# Altium schematic sheet Casing.SchDoc
size A
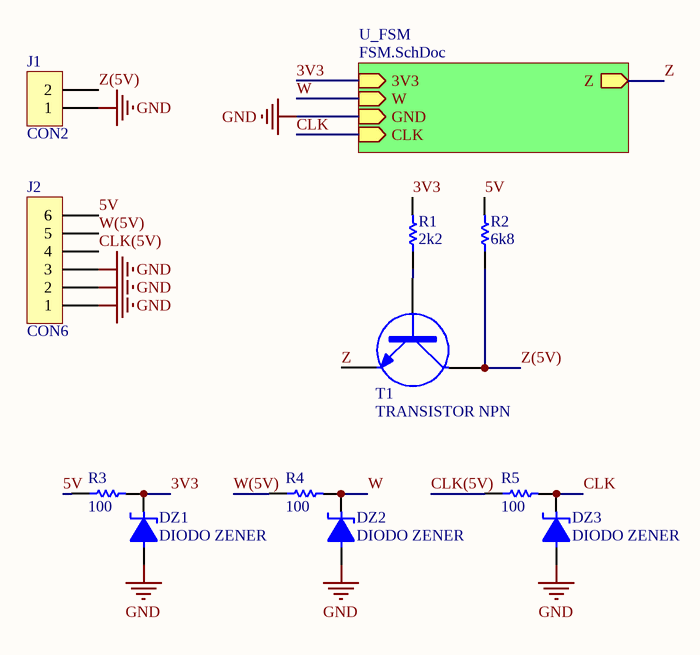
[diagram p0: Casing.SchDoc]

## Parts
DZ1  DIODO ZENER  [DO41]
DZ2  DIODO ZENER  [DO41]
DZ3  DIODO ZENER  [DO41]
J1  CON2  [SIP2]
J2  CON6  [SIP6]
R1  2k2  [0805]
R2  6k8  [0805]
R3  100  [0805]
R4  100  [0805]
R5  100  [0805]
T1  TRANSISTOR NPN  [TO92]

## Sub-sheets
U_FSM = FSM.SchDoc: 3V3 (in), W (in), Z (out), GND (in), CLK (in)

## Nets
GND: DZ1.1 DZ2.1 DZ3.1 J1.1 J2.1 J2.2 J2.3 ; sheet U_FSM/GND
3V3: DZ1.2 R1.2 R3.2 ; sheet U_FSM/3V3
5V: J2.6 R2.2 R3.1
CLK: DZ3.2 R5.2 ; sheet U_FSM/CLK
CLK(5V): J2.4 R5.1
W: DZ2.2 R4.2 ; sheet U_FSM/W
W(5V): J2.5 R4.1
Z: T1.3(E) ; sheet U_FSM/Z
Z(5V): J1.2 R2.1 T1.2(C)
NetR1_1: R1.1 T1.1(B)

## Library data of the parts
R1-R5 = RES